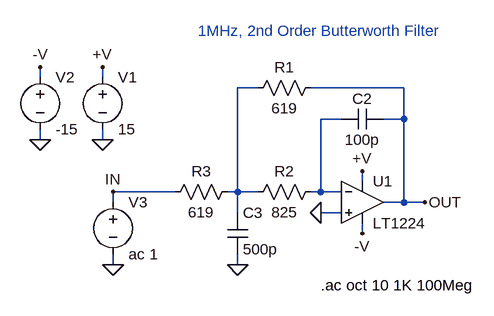
[diagram p0: schematic 1224.asc]
1224.asc, the LTspice schematic file:
Version 4
SHEET 1 896 680
WIRE -208 48 -208 32
WIRE -112 48 -112 32
WIRE 128 64 96 64
WIRE 352 64 208 64
WIRE 256 112 224 112
WIRE 352 112 352 64
WIRE 352 112 320 112
WIRE -208 144 -208 128
WIRE -112 144 -112 128
WIRE 288 208 288 192
WIRE 0 224 -96 224
WIRE 96 224 96 64
WIRE 96 224 80 224
WIRE 128 224 96 224
WIRE 224 224 224 112
WIRE 224 224 208 224
WIRE 256 224 224 224
WIRE -96 240 -96 224
WIRE 352 240 352 112
WIRE 352 240 320 240
WIRE 384 240 352 240
WIRE 96 256 96 224
WIRE 256 256 224 256
WIRE 288 288 288 272
WIRE -96 336 -96 320
WIRE 96 336 96 320
FLAG -112 144 0
FLAG 288 192 +V
FLAG -112 32 +V
FLAG 288 288 -V
FLAG -208 144 0
FLAG -208 32 -V
FLAG 96 336 0
FLAG 224 256 0
FLAG -96 336 0
FLAG 384 240 OUT
FLAG -96 224 IN
SYMBOL voltage -112 32 R0
SYMATTR InstName V1
SYMATTR Value 15
SYMBOL voltage -208 32 R0
SYMATTR InstName V2
SYMATTR Value -15
SYMBOL res 224 48 R90
WINDOW 0 0 56 VBottom 2
WINDOW 3 32 56 VTop 2
SYMATTR InstName R1
SYMATTR Value 619
SYMBOL opamps\\LT1224 288 176 R0
SYMATTR InstName U1
SYMBOL cap 320 96 R90
WINDOW 0 0 32 VBottom 2
WINDOW 3 32 32 VTop 2
SYMATTR InstName C2
SYMATTR Value 100p
SYMBOL cap 80 320 M180
WINDOW 0 24 64 Left 2
WINDOW 3 24 8 Left 2
SYMATTR InstName C3
SYMATTR Value 500p
SYMBOL res 224 208 R90
WINDOW 0 0 56 VBottom 2
WINDOW 3 32 56 VTop 2
SYMATTR InstName R2
SYMATTR Value 825
SYMBOL res 96 208 R90
WINDOW 0 0 56 VBottom 2
WINDOW 3 32 56 VTop 2
SYMATTR InstName R3
SYMATTR Value 619
SYMBOL voltage -96 224 R0
SYMATTR InstName V3
SYMATTR Value ac 1
TEXT 224 368 Left 2 !.ac oct 10 1K 100Meg
TEXT 224 -8 Bottom 2 ;1MHz, 2nd Order Butterworth Filter

The netlist it stands for:
* 1224.asc
V1 +V 0 15
V2 -V 0 -15
R1 OUT N001 619
XU1 0 N002 +V -V OUT LT1224  ; pins In+ In- V+ V- OUT
C2 OUT N002 100p
C3 0 N001 500p
R2 N002 N001 825
R3 N001 IN 619
V3 IN 0 ac 1
.ac oct 10 1K 100Meg
* 1MHz, 2nd Order Butterworth Filter
.backanno
.end